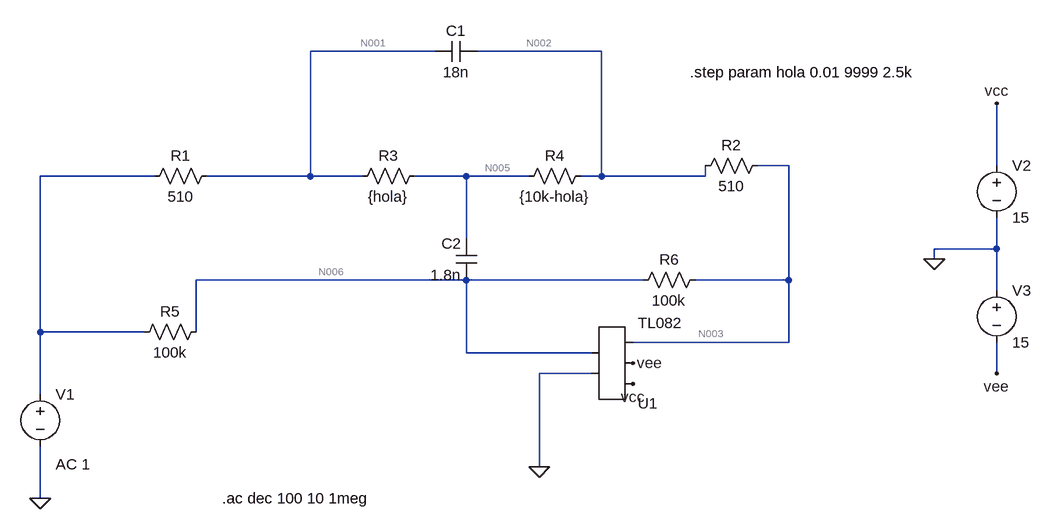
[diagram p0: schematic Spice.asc]
* Spice.asc
R1 N001 N004 510
R2 N003 N002 510
R3 N005 N001 {hola}
R4 N002 N005 {10k-hola}
R5 N006 N004 100k
R6 N003 N006 100k
C1 N002 N001 18n
C2 N006 N005 1.8n
V1 N004 0 AC 1
V2 vcc 0 15
V3 0 vee 15
* U1: TL082 (symbol AutoGenerated\TL082 not available, pins judged from their places): pin1=0 pin2=N006 pin3=vcc pin4=vee pin5=N003
.ac dec 100 10 1meg
.step param hola 0.01 9999 2.5k
.backanno
.end

* Results of the author's LTspice run, read from the files saved beside the schematic
* Operating Point (first step), zero values left out:
*   hola = 10 m
*   V(n001) = 1.224 µV
*   V(n003) = 26.45 µV
*   V(n002) = 25.22 µV
*   V(n005) = 1.224 µV
*   V(n006) = 10.97 µV
*   V(vcc) = 15 V
*   V(vee) = -15 V
*   I(R6) = 154.8 pA
*   I(R5) = 109.7 pA
*   I(R4) = 2.4 nA
*   I(R3) = 2.4 nA
*   I(R2) = 2.4 nA
*   I(R1) = 2.4 nA
*   I(V3) = -14.19 mA
*   I(V2) = -14.19 mA
*   I(V1) = 2.51 nA
*   Ix(u1:1) = 45.05 pA
*   Ix(u1:2) = 45.05 pA
*   Ix(u1:3) = 14.19 mA
*   Ix(u1:4) = -14.19 mA
*   Ix(u1:5) = -2.555 nA
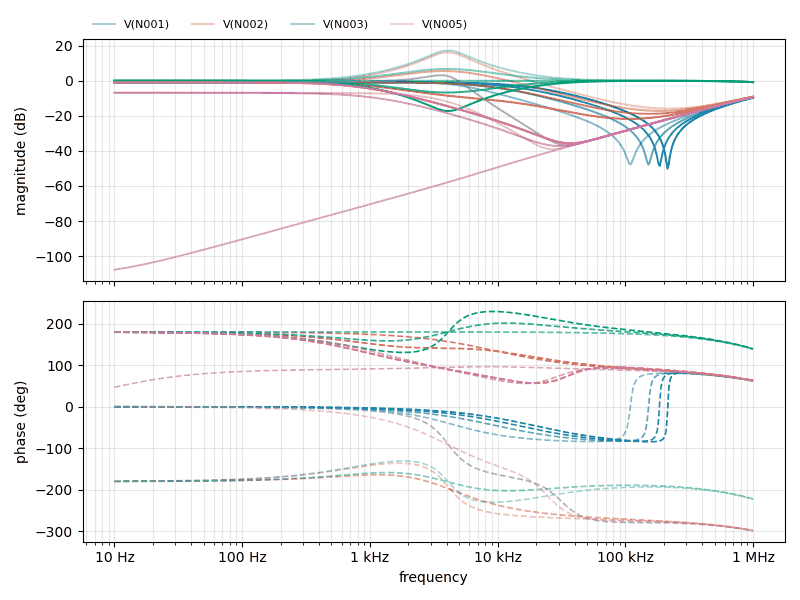
[diagram p1: AC Analysis of Spice.asc, plotted from the saved traces]
* AC Analysis, 5 runs:
*   V(N001) [hola=0.01]: -0.84 dB at 10 Hz, -9.39 dB at 1 MHz, peak 3.17 dB at 3.631 kHz, 3 dB below the peak at 1.569 kHz and 4.84 kHz
*   V(N001) [hola=2500.01]: -0.84 dB at 10 Hz, -9.47 dB at 1 MHz, peak -0.71 dB at 1.66 kHz, 3 dB below the peak at 5.98 kHz
*   V(N001) [hola=5000.01]: -0.84 dB at 10 Hz, -9.55 dB at 1 MHz, peak -0.84 dB at 10 Hz, 3 dB below the peak at 9.485 kHz
*   V(N001) [hola=7500.01]: -0.84 dB at 10 Hz, -9.62 dB at 1 MHz, peak -0.84 dB at 10 Hz, 3 dB below the peak at 13.92 kHz
*   V(N001) [hola=9999]: -0.84 dB at 10 Hz, -9.71 dB at 1 MHz, peak -0.84 dB at 10 Hz, 3 dB below the peak at 18.94 kHz
*   V(N002) [hola=0.01]: -0.84 dB at 10 Hz, -9.01 dB at 1 MHz, peak 16.26 dB at 4.074 kHz, 3 dB below the peak at 2.912 kHz and 5.631 kHz
*   V(N002) [hola=2500.01]: -0.84 dB at 10 Hz, -9.08 dB at 1 MHz, peak 5.51 dB at 3.802 kHz, 3 dB below the peak at 1.391 kHz and 8.543 kHz
*   V(N002) [hola=5000.01]: -0.84 dB at 10 Hz, -9.16 dB at 1 MHz, peak -0.84 dB at 10 Hz, 3 dB below the peak at 9.636 kHz
*   V(N002) [hola=7500.01]: -0.84 dB at 10 Hz, -9.23 dB at 1 MHz, peak -0.84 dB at 10 Hz, 3 dB below the peak at 1.289 kHz
*   V(N002) [hola=9999]: -0.84 dB at 10 Hz, -9.31 dB at 1 MHz, peak -0.84 dB at 10 Hz, 3 dB below the peak at 878.1 Hz
*   V(N003) [hola=0.01]: 0.00 dB at 10 Hz, -0.83 dB at 1 MHz, peak 17.29 dB at 4.074 kHz, 3 dB below the peak at 2.933 kHz and 5.702 kHz
*   V(N003) [hola=2500.01]: 0.00 dB at 10 Hz, -0.82 dB at 1 MHz, peak 6.73 dB at 3.981 kHz, 3 dB below the peak at 1.492 kHz and 10.83 kHz
*   V(N003) [hola=5000.01]: -0.00 dB at 10 Hz, -0.80 dB at 1 MHz, peak 0.01 dB at 32.36 kHz
*   V(N003) [hola=7500.01]: -0.00 dB at 10 Hz, -0.79 dB at 1 MHz, peak -0.00 dB at 10 Hz, 3 dB below the peak at 1.251 kHz
*   V(N003) [hola=9999]: -0.00 dB at 10 Hz, -0.77 dB at 1 MHz, peak -0.00 dB at 10 Hz, 3 dB below the peak at 822.8 Hz
*   V(N005) [hola=0.01]: -0.84 dB at 10 Hz, -9.39 dB at 1 MHz, peak 3.17 dB at 3.631 kHz, 3 dB below the peak at 1.569 kHz and 4.84 kHz
*   V(N005) [hola=2500.01]: -6.86 dB at 10 Hz, -9.37 dB at 1 MHz, peak -6.86 dB at 10 Hz, 3 dB below the peak at 3.06 kHz
*   V(N005) [hola=5000.01]: -107.74 dB at 10 Hz, -9.35 dB at 1 MHz, peak -9.35 dB at 1 MHz, 3 dB below the peak at 671 kHz
*   V(N005) [hola=7500.01]: -6.86 dB at 10 Hz, -9.33 dB at 1 MHz, peak -6.86 dB at 10 Hz, 3 dB below the peak at 1.128 kHz
*   V(N005) [hola=9999]: -0.85 dB at 10 Hz, -9.31 dB at 1 MHz, peak -0.85 dB at 10 Hz, 3 dB below the peak at 878.1 Hz